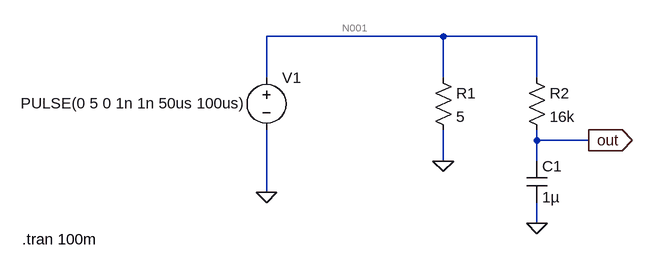
[diagram p0: schematic PWM-Filter.asc]
PWM-Filter.asc, the LTspice schematic file:
Version 4
SHEET 1 880 680
WIRE 384 -96 112 -96
WIRE 528 -96 384 -96
WIRE 112 -32 112 -96
WIRE 384 -32 384 -96
WIRE 528 -32 528 -96
WIRE 528 64 528 48
WIRE 608 64 528 64
WIRE 384 96 384 48
WIRE 528 96 528 64
WIRE 112 144 112 48
WIRE 528 192 528 160
FLAG 112 144 0
FLAG 528 192 0
FLAG 608 64 out
IOPIN 608 64 Out
FLAG 384 96 0
SYMBOL voltage 112 -48 R0
WINDOW 3 -378 55 Left 2
WINDOW 123 0 0 Left 0
WINDOW 39 0 0 Left 0
SYMATTR InstName V1
SYMATTR Value PULSE(0 5 0 1n 1n 50us 100us)
SYMBOL res 368 -48 R0
SYMATTR InstName R1
SYMATTR Value 5
SYMBOL res 512 -48 R0
SYMATTR InstName R2
SYMATTR Value 16k
SYMBOL cap 512 96 R0
SYMATTR InstName C1
SYMATTR Value 1µ
TEXT -264 216 Left 2 !.tran 100m

The netlist it stands for:
* PWM-Filter.asc
V1 N001 0 PULSE(0 5 0 1n 1n 50us 100us)
R1 N001 0 5
R2 N001 out 16k
C1 out 0 1µ
.tran 100m
.backanno
.end

* Results of the author's LTspice run, read from the files saved beside the schematic
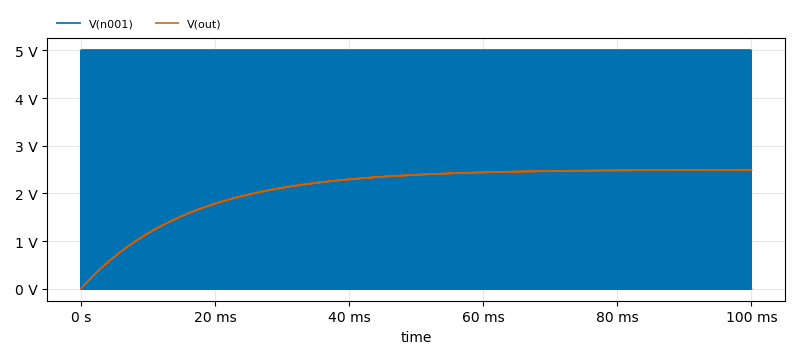
[diagram p1: Transient Analysis of PWM-Filter.asc, plotted from the saved traces]
* Transient Analysis, 1 run:
*   V(n001): min 0 V, max 5 V, average 2.5 V, rms 3.536 V, last 0 V
*   V(out): min 0 V, max 2.499 V, average 2.101 V, rms 2.181 V, last 2.491 V